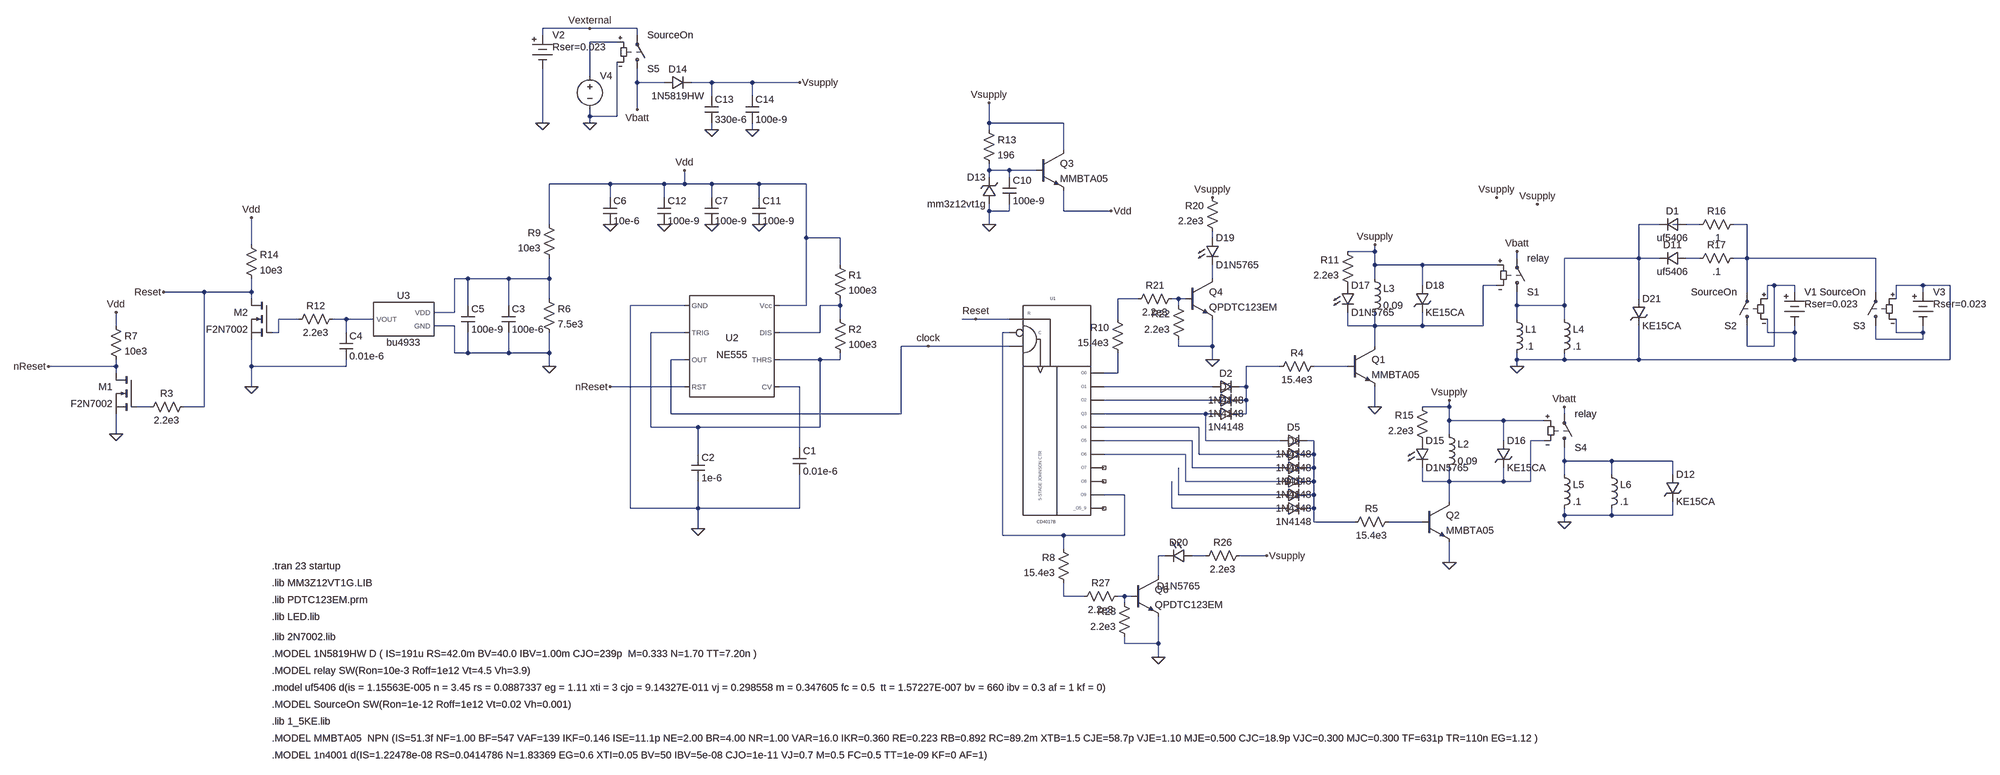
[diagram p0: schematic LockSequencer-7.asc]
LockSequencer-7.asc, the LTspice schematic file:
Version 4
SHEET 1 3068 1176
WIRE -880 -704 -992 -704
WIRE -768 -704 -880 -704
WIRE -992 -688 -992 -704
WIRE -768 -688 -768 -704
WIRE -816 -672 -880 -672
WIRE -880 -592 -880 -672
WIRE -768 -576 -768 -608
WIRE -704 -576 -768 -576
WIRE -592 -576 -640 -576
WIRE -496 -576 -592 -576
WIRE -384 -576 -496 -576
WIRE -592 -544 -592 -576
WIRE -496 -544 -496 -576
WIRE -768 -512 -768 -576
WIRE -880 -496 -880 -512
WIRE -816 -496 -816 -624
WIRE -816 -496 -880 -496
WIRE -992 -480 -992 -608
WIRE -880 -480 -880 -496
WIRE 64 -480 64 -528
WIRE 240 -480 64 -480
WIRE -592 -464 -592 -480
WIRE -496 -464 -496 -480
WIRE 64 -464 64 -480
WIRE 240 -416 240 -480
WIRE 64 -368 64 -384
WIRE 112 -368 64 -368
WIRE 176 -368 112 -368
WIRE 64 -352 64 -368
WIRE 112 -352 112 -368
WIRE -832 -336 -976 -336
WIRE -704 -336 -832 -336
WIRE -656 -336 -656 -368
WIRE -656 -336 -704 -336
WIRE -592 -336 -656 -336
WIRE -480 -336 -592 -336
WIRE -368 -336 -480 -336
WIRE -832 -304 -832 -336
WIRE -704 -304 -704 -336
WIRE -592 -304 -592 -336
WIRE -480 -304 -480 -336
WIRE 64 -272 64 -288
WIRE 112 -272 112 -288
WIRE 112 -272 64 -272
WIRE 240 -272 240 -320
WIRE 352 -272 240 -272
WIRE -976 -240 -976 -336
WIRE 64 -240 64 -272
WIRE 1648 -240 1600 -240
WIRE 1696 -240 1680 -240
WIRE 1744 -240 1712 -240
WIRE 1856 -240 1824 -240
WIRE -368 -208 -368 -336
WIRE -288 -208 -368 -208
WIRE 592 -208 592 -224
WIRE -1680 -192 -1680 -256
WIRE 976 -176 976 -192
WIRE 976 -176 912 -176
WIRE 1312 -160 1312 -176
WIRE 1600 -160 1600 -240
WIRE 1600 -160 1424 -160
WIRE 1648 -160 1600 -160
WIRE 1744 -160 1712 -160
WIRE 1856 -160 1856 -240
WIRE 1856 -160 1824 -160
WIRE 2160 -160 1856 -160
WIRE -288 -144 -288 -208
WIRE 976 -144 976 -176
WIRE 1088 -144 976 -144
WIRE 1264 -144 1088 -144
WIRE -1168 -112 -1200 -112
WIRE -1072 -112 -1168 -112
WIRE -976 -112 -976 -160
WIRE -976 -112 -1072 -112
WIRE 592 -112 592 -144
WIRE 976 -112 976 -144
WIRE 1088 -96 1088 -144
WIRE 1264 -96 1232 -96
WIRE 1920 -96 1904 -96
WIRE 1968 -96 1920 -96
WIRE 2272 -96 2208 -96
WIRE 2336 -96 2272 -96
WIRE -1792 -80 -1888 -80
WIRE -1680 -80 -1680 -112
WIRE -1680 -80 -1792 -80
WIRE 1856 -80 1856 -160
WIRE 1968 -80 1968 -96
WIRE 2160 -80 2160 -160
WIRE 2272 -80 2272 -96
WIRE -1680 -64 -1680 -80
WIRE -976 -64 -976 -112
WIRE 416 -64 368 -64
WIRE 512 -64 496 -64
WIRE 528 -64 512 -64
WIRE 1600 -64 1600 -160
WIRE 1904 -64 1904 -96
WIRE 2208 -64 2208 -96
WIRE -1168 -48 -1168 -112
WIRE -1072 -48 -1072 -112
WIRE -656 -48 -784 -48
WIRE -368 -48 -368 -208
WIRE -368 -48 -432 -48
WIRE -288 -48 -288 -64
WIRE -288 -48 -336 -48
WIRE 512 -48 512 -64
WIRE 1312 -48 1312 -80
WIRE 1424 -48 1424 -160
WIRE 1424 -48 1312 -48
WIRE -1200 -32 -1200 -112
WIRE -1200 -32 -1248 -32
WIRE -1568 -16 -1616 -16
WIRE -1456 -16 -1488 -16
WIRE -1392 -16 -1456 -16
WIRE -288 -16 -288 -48
WIRE 32 -16 0 -16
WIRE 112 -16 32 -16
WIRE 368 -16 368 -64
WIRE 1312 -16 1312 -48
WIRE 1424 -16 1424 -48
WIRE -2000 0 -2000 -32
WIRE -1200 0 -1248 0
WIRE 912 0 912 -32
WIRE 976 0 976 -32
WIRE 976 0 912 0
WIRE 1088 0 1088 -32
WIRE 1088 0 976 0
WIRE 1232 0 1232 -96
WIRE 1232 0 1088 0
WIRE -1616 16 -1616 -16
WIRE -1616 16 -1632 16
WIRE -1456 16 -1456 -16
WIRE -656 16 -736 16
WIRE -336 16 -336 -48
WIRE -336 16 -432 16
WIRE 112 16 96 16
WIRE 1904 16 1904 -16
WIRE 1968 16 1968 0
WIRE 1968 16 1904 16
WIRE 2208 16 2208 -16
WIRE 2272 16 2272 0
WIRE 2272 16 2208 16
WIRE 2160 32 2160 0
WIRE 2272 32 2272 16
WIRE 2272 32 2160 32
WIRE -80 48 -144 48
WIRE 112 48 -80 48
WIRE 512 48 512 32
WIRE 592 48 592 -16
WIRE 592 48 512 48
WIRE 976 48 976 0
WIRE 1856 48 1856 0
WIRE 1920 48 1920 -96
WIRE 1920 48 1856 48
WIRE -1200 64 -1200 0
WIRE -1168 64 -1168 16
WIRE -1168 64 -1200 64
WIRE -1072 64 -1072 16
WIRE -1072 64 -1168 64
WIRE -976 64 -976 16
WIRE -976 64 -1072 64
WIRE -656 80 -688 80
WIRE -336 80 -432 80
WIRE -288 80 -288 64
WIRE -288 80 -336 80
WIRE 592 80 592 48
WIRE 1312 80 1312 64
WIRE 1424 80 1424 64
WIRE 1424 80 1312 80
WIRE 1600 80 1600 0
WIRE 1600 80 1424 80
WIRE 1968 80 1968 16
WIRE 1968 80 1600 80
WIRE 2336 80 2336 -96
WIRE 2336 80 1968 80
WIRE -2000 96 -2000 80
WIRE -2000 96 -2160 96
WIRE -1680 96 -1680 32
WIRE -1456 96 -1456 80
WIRE -1456 96 -1680 96
WIRE -976 96 -976 64
WIRE 752 96 672 96
WIRE 912 96 832 96
WIRE 1312 96 1312 80
WIRE -2000 112 -2000 96
WIRE 368 112 368 64
WIRE 368 112 336 112
WIRE -1680 144 -1680 96
WIRE -656 144 -832 144
WIRE -384 144 -432 144
WIRE 592 144 336 144
WIRE 672 144 672 96
WIRE 672 144 656 144
WIRE 592 176 336 176
WIRE 672 176 672 144
WIRE 672 176 656 176
WIRE -1920 192 -1952 192
WIRE -1792 192 -1792 -80
WIRE -1792 192 -1840 192
WIRE 976 192 976 144
WIRE 1152 192 1152 176
WIRE 1152 192 1088 192
WIRE -688 208 -688 80
WIRE -144 208 -144 48
WIRE -144 208 -688 208
WIRE 576 208 336 208
WIRE 592 208 576 208
WIRE 672 208 672 176
WIRE 672 208 656 208
WIRE 1424 208 1424 192
WIRE 1152 224 1152 192
WIRE 1280 224 1152 224
WIRE 1376 224 1280 224
WIRE -736 240 -736 16
WIRE -624 240 -736 240
WIRE -336 240 -336 80
WIRE -336 240 -624 240
WIRE 560 240 336 240
WIRE -2000 256 -2000 208
WIRE 1152 256 1152 224
WIRE 544 272 336 272
WIRE 576 272 576 208
WIRE 752 272 576 272
WIRE 832 272 816 272
WIRE 1280 272 1280 224
WIRE 1376 272 1344 272
WIRE -384 288 -384 144
WIRE -624 304 -624 240
WIRE 528 304 336 304
WIRE 560 304 560 240
WIRE 752 304 560 304
WIRE 832 304 832 272
WIRE 832 304 816 304
WIRE 1424 320 1424 288
WIRE 1536 320 1424 320
WIRE 1680 320 1536 320
WIRE 544 336 544 272
WIRE 752 336 544 336
WIRE 832 336 832 304
WIRE 832 336 816 336
WIRE 1424 352 1424 320
WIRE 1536 352 1536 320
WIRE 1680 352 1680 320
WIRE 528 368 528 304
WIRE 752 368 528 368
WIRE 832 368 832 336
WIRE 832 368 816 368
WIRE 1088 368 1088 336
WIRE 1152 368 1152 336
WIRE 1152 368 1088 368
WIRE 1280 368 1280 336
WIRE 1280 368 1152 368
WIRE 1344 368 1344 272
WIRE 1344 368 1280 368
WIRE 384 400 336 400
WIRE 512 400 512 336
WIRE 752 400 512 400
WIRE 832 400 832 368
WIRE 832 400 816 400
WIRE 1152 416 1152 368
WIRE -784 432 -784 -48
WIRE -624 432 -624 368
WIRE -624 432 -784 432
WIRE -384 432 -384 352
WIRE -384 432 -624 432
WIRE 496 432 496 368
WIRE 752 432 496 432
WIRE 832 432 832 400
WIRE 832 432 816 432
WIRE 1424 448 1424 432
WIRE 1536 448 1536 432
WIRE 1536 448 1424 448
WIRE 1680 448 1680 416
WIRE 1680 448 1536 448
WIRE 832 464 832 432
WIRE 928 464 832 464
WIRE 1088 464 1008 464
WIRE 1424 464 1424 448
WIRE -624 480 -624 432
WIRE 96 496 96 16
WIRE 240 496 96 496
WIRE 384 496 384 400
WIRE 384 496 240 496
WIRE 240 528 240 496
WIRE 480 544 464 544
WIRE 576 544 544 544
WIRE 720 544 656 544
WIRE 1152 560 1152 512
WIRE 464 592 464 544
WIRE 240 640 240 608
WIRE 288 640 240 640
WIRE 384 640 368 640
WIRE 400 640 384 640
WIRE 384 656 384 640
WIRE 384 752 384 736
WIRE 464 752 464 688
WIRE 464 752 384 752
WIRE 464 784 464 752
FLAG -624 480 0
FLAG -656 -368 Vdd
FLAG -976 96 0
FLAG -1680 144 0
FLAG -1888 -80 Reset
FLAG 32 -16 Reset
FLAG -2000 -32 Vdd
FLAG -1680 -256 Vdd
FLAG -2160 96 nReset
FLAG -832 144 nReset
FLAG -2000 256 0
FLAG 976 192 0
FLAG -832 -240 0
FLAG -592 -240 0
FLAG -768 -512 Vbatt
FLAG 64 -240 0
FLAG 64 -528 Vsupply
FLAG 352 -272 Vdd
FLAG -384 -576 Vsupply
FLAG 1152 176 Vsupply
FLAG -80 48 clock
FLAG 976 -192 Vsupply
FLAG 1424 192 Vbatt
FLAG 1312 96 0
FLAG 1312 -176 Vbatt
FLAG 1424 464 0
FLAG 1264 -304 Vsupply
FLAG 1360 -288 Vsupply
FLAG -496 -464 0
FLAG -592 -464 0
FLAG -480 -240 0
FLAG -704 -240 0
FLAG -992 -480 0
FLAG -880 -480 0
FLAG 592 80 0
FLAG 592 -304 Vsupply
FLAG -880 -704 Vexternal
FLAG 464 784 0
FLAG 720 544 Vsupply
FLAG 1152 560 0
SYMBOL Misc\\NE555 -544 48 R0
SYMATTR InstName U2
SYMBOL cap -400 288 R0
SYMATTR InstName C1
SYMATTR Value 0.01e-6
SYMATTR SpiceLine V=16
SYMBOL cap -640 304 R0
SYMATTR InstName C2
SYMATTR Value 1e-6
SYMATTR SpiceLine V=16
SYMBOL res -304 -160 R0
SYMATTR InstName R1
SYMATTR Value 100e3
SYMBOL res -304 -32 R0
SYMATTR InstName R2
SYMATTR Value 100e3
SYMBOL cap -1088 -48 R0
SYMATTR InstName C3
SYMATTR Value 100e-6
SYMATTR SpiceLine V=16
SYMBOL res -992 -80 R0
SYMATTR InstName R6
SYMATTR Value 7.5e3
SYMBOL res -960 -144 R180
WINDOW 0 36 76 Left 2
WINDOW 3 36 40 Left 2
SYMATTR InstName R9
SYMATTR Value 10e3
SYMBOL bu4933 -1328 -16 R0
SYMATTR InstName U3
SYMBOL res -1472 -32 R90
WINDOW 0 0 56 VBottom 2
WINDOW 3 32 56 VTop 2
SYMATTR InstName R12
SYMATTR Value 2.2e3
SYMBOL res -1696 -208 R0
SYMATTR InstName R14
SYMATTR Value 10e3
SYMBOL nmos -1632 -64 M0
SYMATTR InstName M2
SYMATTR Value F2N7002
SYMATTR Prefix X
SYMBOL nmos -1952 112 M0
SYMATTR InstName M1
SYMATTR Value F2N7002
SYMATTR Prefix X
SYMBOL res -2016 -16 R0
SYMATTR InstName R7
SYMATTR Value 10e3
SYMBOL cap -1184 -48 R0
SYMATTR InstName C5
SYMATTR Value 100e-9
SYMATTR SpiceLine V=16
SYMBOL diode 592 160 R270
WINDOW 0 32 32 VTop 2
WINDOW 3 0 32 VBottom 2
SYMATTR InstName D2
SYMATTR Value 1N4148
SYMBOL diode 592 192 R270
WINDOW 0 32 32 VTop 2
WINDOW 3 0 32 VBottom 2
SYMATTR InstName D3
SYMATTR Value 1N4148
SYMBOL diode 592 224 R270
WINDOW 0 32 32 VTop 2
WINDOW 3 0 32 VBottom 2
SYMATTR InstName D4
SYMATTR Value 1N4148
SYMBOL diode 752 288 R270
WINDOW 0 32 32 VTop 2
WINDOW 3 0 32 VBottom 2
SYMATTR InstName D5
SYMATTR Value 1N4148
SYMBOL diode 752 320 R270
WINDOW 0 32 32 VTop 2
WINDOW 3 0 32 VBottom 2
SYMATTR InstName D6
SYMATTR Value 1N4148
SYMBOL diode 752 352 R270
WINDOW 0 32 32 VTop 2
WINDOW 3 0 32 VBottom 2
SYMATTR InstName D7
SYMATTR Value 1N4148
SYMBOL diode 752 448 R270
WINDOW 0 32 32 VTop 2
WINDOW 3 0 32 VBottom 2
SYMATTR InstName D8
SYMATTR Value 1N4148
SYMBOL diode 752 384 R270
WINDOW 0 32 32 VTop 2
WINDOW 3 0 32 VBottom 2
SYMATTR InstName D9
SYMATTR Value 1N4148
SYMBOL diode 752 416 R270
WINDOW 0 32 32 VTop 2
WINDOW 3 0 32 VBottom 2
SYMATTR InstName D10
SYMATTR Value 1N4148
SYMBOL cap -848 -304 R0
SYMATTR InstName C6
SYMATTR Value 10e-6
SYMATTR SpiceLine V=16
SYMBOL cap -608 -304 R0
SYMATTR InstName C7
SYMATTR Value 100e-9
SYMATTR SpiceLine V=16
SYMBOL ind 1136 240 R0
SYMATTR InstName L2
SYMATTR Value 0.09
SYMATTR SpiceLine Rser=320
SYMBOL Misc\\battery -992 -704 R0
WINDOW 123 0 0 Left 2
WINDOW 39 24 44 Left 2
WINDOW 3 24 104 Invisible 2
SYMATTR SpiceLine Rser=0.023
SYMATTR Value PWL(0 0 .25 5 0.5 5 0.55 12.75 2 12.75 3 13.8 3.1 0)
SYMATTR InstName V2
SYMBOL diode -704 -560 R270
WINDOW 0 32 32 VTop 2
WINDOW 3 0 32 VBottom 2
SYMATTR InstName D14
SYMATTR Value 1N5819HW
SYMBOL res 48 -480 R0
SYMATTR InstName R13
SYMATTR Value 196
SYMBOL zener 80 -288 R180
WINDOW 0 24 64 Left 2
WINDOW 3 24 0 Left 2
SYMATTR InstName D13
SYMATTR Value mm3z12vt1g
SYMATTR Prefix X
SYMBOL cap 96 -352 R0
SYMATTR InstName C10
SYMATTR Value 100e-9
SYMATTR SpiceLine V=16
SYMBOL LED 1072 272 R0
SYMATTR InstName D15
SYMATTR Value D1N5765
SYMATTR Prefix X
SYMBOL ind 960 -128 R0
SYMATTR InstName L3
SYMATTR Value 0.09
SYMATTR SpiceLine Rser=320
SYMBOL LED 896 -96 R0
SYMATTR InstName D17
SYMATTR Value D1N5765
SYMATTR Prefix X
SYMBOL sw 1312 -64 M180
SYMATTR InstName S1
SYMATTR Value relay
SYMBOL ind 1296 -32 R0
SYMATTR InstName L1
SYMATTR Value .1
SYMATTR SpiceLine Rser=12
SYMBOL ind 1408 -32 R0
SYMATTR InstName L4
SYMATTR Value .1
SYMATTR SpiceLine Rser=12
SYMBOL Misc\\battery 1968 -96 R0
WINDOW 123 0 0 Left 2
WINDOW 39 24 44 Left 2
WINDOW 3 24 104 Invisible 2
SYMATTR SpiceLine Rser=0.023
SYMATTR Value PWL(0 0 13.19 0 13.2 12.6 16 12.6 16.01 0)
SYMATTR InstName V1
SYMBOL sw 1856 16 R180
SYMATTR InstName S2
SYMATTR Value SourceOn
SYMBOL Misc\\battery 2272 -96 R0
WINDOW 123 0 0 Left 2
WINDOW 39 24 44 Left 2
WINDOW 3 24 104 Invisible 2
SYMATTR SpiceLine Rser=0.023
SYMATTR Value PWL(0 0 20 0 20.01 12.6 22.00 12.6 22.01 0)
SYMATTR InstName V3
SYMBOL sw 2160 16 R180
SYMATTR InstName S3
SYMATTR Value SourceOn
SYMBOL diode 1712 -176 R90
WINDOW 0 0 32 VBottom 2
WINDOW 3 32 32 VTop 2
SYMATTR InstName D11
SYMATTR Value uf5406
SYMBOL sw 1424 304 M180
SYMATTR InstName S4
SYMATTR Value relay
SYMBOL ind 1408 336 R0
SYMATTR InstName L5
SYMATTR Value .1
SYMATTR SpiceLine Rser=12
SYMBOL ind 1520 336 R0
SYMATTR InstName L6
SYMATTR Value .1
SYMATTR SpiceLine Rser=12
SYMBOL cap -496 -304 R0
SYMATTR InstName C11
SYMATTR Value 100e-9
SYMATTR SpiceLine V=16
SYMBOL cap -720 -304 R0
SYMATTR InstName C12
SYMATTR Value 100e-9
SYMATTR SpiceLine V=16
SYMBOL cap -608 -544 R0
SYMATTR InstName C13
SYMATTR Value 330e-6
SYMATTR SpiceLine V=16
SYMBOL cap -512 -544 R0
SYMATTR InstName C14
SYMATTR Value 100e-9
SYMATTR SpiceLine V=16
SYMBOL LED 576 -208 R0
SYMATTR InstName D19
SYMATTR Value D1N5765
SYMATTR Prefix X
SYMBOL res 608 -208 R180
WINDOW 0 36 76 Left 2
WINDOW 3 36 40 Left 2
SYMATTR InstName R20
SYMATTR Value 2.2e3
SYMBOL sw -768 -592 M180
SYMATTR InstName S5
SYMATTR Value SourceOn
SYMBOL voltage -880 -608 R0
WINDOW 3 24 96 Invisible 2
WINDOW 123 0 0 Left 2
WINDOW 39 0 0 Left 2
SYMATTR Value PWL(0 1 3.1 1 3.11 0)
SYMATTR InstName V4
SYMBOL npn 528 -112 R0
SYMATTR InstName Q4
SYMATTR Value QPDTC123EM
SYMBOL res 512 -80 R90
WINDOW 0 0 56 VBottom 2
WINDOW 3 32 56 VTop 2
SYMATTR InstName R21
SYMATTR Value 2.2e3
SYMBOL res 528 48 R180
WINDOW 0 36 76 Left 2
WINDOW 3 36 40 Left 2
SYMATTR InstName R22
SYMATTR Value 2.2e3
SYMBOL res 560 560 R270
WINDOW 0 32 56 VTop 2
WINDOW 3 0 56 VBottom 2
SYMATTR InstName R26
SYMATTR Value 2.2e3
SYMBOL npn 400 592 R0
SYMATTR InstName Q6
SYMATTR Value QPDTC123EM
SYMBOL res 384 624 R90
WINDOW 0 0 56 VBottom 2
WINDOW 3 32 56 VTop 2
SYMATTR InstName R27
SYMATTR Value 2.2e3
SYMBOL res 400 752 R180
WINDOW 0 36 76 Left 2
WINDOW 3 36 40 Left 2
SYMATTR InstName R28
SYMATTR Value 2.2e3
SYMBOL LED 544 528 R90
WINDOW 0 0 32 VBottom 2
WINDOW 3 72 32 VTop 2
SYMATTR InstName D20
SYMATTR Value D1N5765
SYMATTR Prefix X
SYMBOL cap -1472 16 R0
SYMATTR InstName C4
SYMATTR Value 0.01e-6
SYMATTR SpiceLine V=16
SYMBOL res -1824 176 R90
WINDOW 0 0 56 VBottom 2
WINDOW 3 32 56 VTop 2
SYMATTR InstName R3
SYMATTR Value 2.2e3
SYMBOL npn 912 48 R0
SYMATTR InstName Q1
SYMATTR Value MMBTA05
SYMBOL res 848 80 R90
WINDOW 0 0 56 VBottom 2
WINDOW 3 32 56 VTop 2
SYMATTR InstName R4
SYMATTR Value 15.4e3
SYMBOL npn 1088 416 R0
SYMATTR InstName Q2
SYMATTR Value MMBTA05
SYMBOL res 1024 448 R90
WINDOW 0 0 56 VBottom 2
WINDOW 3 32 56 VTop 2
SYMATTR InstName R5
SYMATTR Value 15.4e3
SYMBOL res 384 80 R180
WINDOW 0 36 76 Left 2
WINDOW 3 36 40 Left 2
SYMATTR InstName R10
SYMATTR Value 15.4e3
SYMBOL res 256 624 R180
WINDOW 0 36 76 Left 2
WINDOW 3 36 40 Left 2
SYMATTR InstName R8
SYMATTR Value 15.4e3
SYMBOL npn 176 -416 R0
SYMATTR InstName Q3
SYMATTR Value MMBTA05
SYMBOL res 928 -80 R180
WINDOW 0 36 76 Left 2
WINDOW 3 36 40 Left 2
SYMATTR InstName R11
SYMATTR Value 2.2e3
SYMBOL res 1104 288 R180
WINDOW 0 36 76 Left 2
WINDOW 3 36 40 Left 2
SYMATTR InstName R15
SYMATTR Value 2.2e3
SYMBOL diode 1712 -256 R90
WINDOW 0 0 32 VBottom 2
WINDOW 3 32 32 VTop 2
SYMATTR InstName D1
SYMATTR Value uf5406
SYMBOL TVSdiode 1072 -96 R0
SYMATTR InstName D18
SYMATTR Value KE15CA
SYMATTR Prefix X
SYMBOL TVSdiode 1584 -64 R0
SYMATTR InstName D21
SYMATTR Value KE15CA
SYMATTR Prefix X
SYMBOL res 1840 -256 R90
WINDOW 0 0 56 VBottom 2
WINDOW 3 32 56 VTop 2
SYMATTR InstName R16
SYMATTR Value .1
SYMBOL res 1840 -176 R90
WINDOW 0 0 56 VBottom 2
WINDOW 3 32 56 VTop 2
SYMATTR InstName R17
SYMATTR Value .1
SYMBOL TVSdiode 1664 352 R0
SYMATTR InstName D12
SYMATTR Value KE15CA
SYMATTR Prefix X
SYMBOL TVSdiode 1264 272 R0
SYMATTR InstName D16
SYMATTR Value KE15CA
SYMATTR Prefix X
SYMBOL cd4017b 224 -80 R0
SYMATTR InstName U1
SYMATTR SpiceLine VDD=11.298  SPEED=1.0  TRIPDT=5e-9
TEXT -1632 568 Left 2 !.tran 23 startup
TEXT -1632 608 Left 2 !.lib MM3Z12VT1G.LIB
TEXT -1632 648 Left 2 !.lib PDTC123EM.prm
TEXT -1632 736 Left 2 !.lib 2N7002.lib
TEXT -1632 776 Left 2 !.MODEL 1N5819HW D ( IS=191u RS=42.0m BV=40.0 IBV=1.00m CJO=239p  M=0.333 N=1.70 TT=7.20n )
TEXT -1632 688 Left 2 !.lib LED.lib
TEXT -1632 816 Left 2 !.MODEL relay SW(Ron=10e-3 Roff=1e12 Vt=4.5 Vh=3.9)
TEXT -1632 856 Left 2 !.model uf5406 d(is = 1.15563E-005 n = 3.45 rs = 0.0887337 eg = 1.11 xti = 3 cjo = 9.14327E-011 vj = 0.298558 m = 0.347605 fc = 0.5  tt = 1.57227E-007 bv = 660 ibv = 0.3 af = 1 kf = 0)
TEXT -1632 896 Left 2 !.MODEL SourceOn SW(Ron=1e-12 Roff=1e12 Vt=0.02 Vh=0.001)
TEXT -1632 936 Left 2 !.lib 1_5KE.lib
TEXT -1632 976 Left 2 !.MODEL MMBTA05  NPN (IS=51.3f NF=1.00 BF=547 VAF=139 IKF=0.146 ISE=11.1p NE=2.00 BR=4.00 NR=1.00 VAR=16.0 IKR=0.360 RE=0.223 RB=0.892 RC=89.2m XTB=1.5 CJE=58.7p VJE=1.10 MJE=0.500 CJC=18.9p VJC=0.300 MJC=0.300 TF=631p TR=110n EG=1.12 )
TEXT -1632 1016 Left 2 !.MODEL 1n4001 d(IS=1.22478e-08 RS=0.0414786 N=1.83369 EG=0.6 XTI=0.05 BV=50 IBV=5e-08 CJO=1e-11 VJ=0.7 M=0.5 FC=0.5 TT=1e-09 KF=0 AF=1)

The netlist it stands for:
* LockSequencer-7.asc
XU2 0 N018 clock nReset N024 N018 N015 Vdd NE555  ; pins GND TRIG OUT RST CV THRS DIS Vcc
C1 N024 0 0.01e-6 V=16
C2 N018 0 1e-6 V=16
R1 Vdd N015 100e3
R2 N015 N018 100e3
C3 N009 0 100e-6 V=16
R6 N009 0 7.5e3
R9 N009 Vdd 10e3
XU3 N017 N009 0 bu4933  ; pins VOUT VDD GND
R12 N017 N016 2.2e3
R14 Vdd Reset 10e3
XM2 Reset N016 0 F2N7002  ; pins D G S
XM1 nReset N027 0 F2N7002  ; pins D G S
R7 Vdd nReset 10e3
C5 N009 0 100e-9 V=16
D2 N025 N021 1N4148
D3 N026 N021 1N4148
D4 N028 N021 1N4148
D5 N028 N031 1N4148
D6 N029 N031 1N4148
D7 N030 N031 1N4148
D8 N036 N031 1N4148
D9 N033 N031 1N4148
D10 N035 N031 1N4148
C6 Vdd 0 10e-6 V=16
C7 Vdd 0 100e-9 V=16
L2 Vsupply N032 0.09 Rser=320
V2 Vexternal 0 PWL(0 0 .25 5 0.5 5 0.55 12.75 2 12.75 3 13.8 3.1 0) Rser=0.023
D14 Vbatt Vsupply 1N5819HW
R13 Vsupply N002 196
XD13 0 N002 mm3z12vt1g  ; pins + -
C10 N002 0 100e-9 V=16
XD15 P001 N032 D1N5765  ; pins + -
L3 Vsupply N011 0.09 Rser=320
XD17 P002 N011 D1N5765  ; pins + -
S1 N003 Vbatt Vsupply N011 relay
L1 N003 0 .1 Rser=12
L4 N003 0 .1 Rser=12
V1 N012 0 PWL(0 0 13.19 0 13.2 12.6 16 12.6 16.01 0) Rser=0.023
S2 N012 N006 N012 0 SourceOn
V3 0 N020 PWL(0 0 20 0 20.01 12.6 22.00 12.6 22.01 0) Rser=0.023
S3 N020 N006 0 N020 SourceOn
D11 N008 N003 uf5406
S4 N034 Vbatt Vsupply N032 relay
L5 N034 0 .1 Rser=12
L6 N034 0 .1 Rser=12
C11 Vdd 0 100e-9 V=16
C12 Vdd 0 100e-9 V=16
C13 Vsupply 0 330e-6 V=16
C14 Vsupply 0 100e-9 V=16
XD19 N007 N010 D1N5765  ; pins + -
R20 N007 Vsupply 2.2e3
S5 Vbatt Vexternal N001 0 SourceOn
V4 N001 0 PWL(0 1 3.1 1 3.11 0)
Q4 N010 N014 0 0 QPDTC123EM
R21 N014 N013 2.2e3
R22 0 N014 2.2e3
R26 N039 Vsupply 2.2e3
Q6 N038 N041 0 0 QPDTC123EM
R27 N041 N040 2.2e3
R28 0 N041 2.2e3
XD20 N039 N038 D1N5765  ; pins + -
C4 N017 0 0.01e-6 V=16
R3 Reset N027 2.2e3
Q1 N011 N022 0 0 MMBTA05
R4 N022 N021 15.4e3
Q2 N032 N037 0 0 MMBTA05
R5 N037 N031 15.4e3
R10 N023 N013 15.4e3
R8 N040 N019 15.4e3
Q3 Vsupply N002 Vdd 0 MMBTA05
R11 P002 Vsupply 2.2e3
R15 P001 Vsupply 2.2e3
D1 N005 N003 uf5406
XD18 Vsupply N011 KE15CA  ; pins + -
XD21 N003 0 KE15CA  ; pins + -
R16 N006 N005 .1
R17 N006 N008 .1
XD12 N034 0 KE15CA  ; pins + -
XD16 Vsupply N032 KE15CA  ; pins + -
XU1 Reset N019 clock N023 N025 N026 N028 N029 N030 N033 NC_01 NC_02 N019 NC_03 VDD 0 CD4017B VDD=11.298  SPEED=1.0  TRIPDT=5e-9  ; pins MR CPN CP Q0 Q1 Q2 Q3 Q4 Q5 Q6 Q7 Q8 Q9 Q59
.model D D
.lib standard.dio
.model NPN NPN
.model PNP PNP
.lib standard.bjt
.tran 23 startup
.lib MM3Z12VT1G.LIB
.lib PDTC123EM.prm
.lib 2N7002.lib
.MODEL 1N5819HW D ( IS=191u RS=42.0m BV=40.0 IBV=1.00m CJO=239p  M=0.333 N=1.70 TT=7.20n )
.lib LED.lib
.MODEL relay SW(Ron=10e-3 Roff=1e12 Vt=4.5 Vh=3.9)
.model uf5406 d(is = 1.15563E-005 n = 3.45 rs = 0.0887337 eg = 1.11 xti = 3 cjo = 9.14327E-011 vj = 0.298558 m = 0.347605 fc = 0.5  tt = 1.57227E-007 bv = 660 ibv = 0.3 af = 1 kf = 0)
.MODEL SourceOn SW(Ron=1e-12 Roff=1e12 Vt=0.02 Vh=0.001)
.lib 1_5KE.lib
.MODEL MMBTA05  NPN (IS=51.3f NF=1.00 BF=547 VAF=139 IKF=0.146 ISE=11.1p NE=2.00 BR=4.00 NR=1.00 VAR=16.0 IKR=0.360 RE=0.223 RB=0.892 RC=89.2m XTB=1.5 CJE=58.7p VJE=1.10 MJE=0.500 CJC=18.9p VJC=0.300 MJC=0.300 TF=631p TR=110n EG=1.12 )
.MODEL 1n4001 d(IS=1.22478e-08 RS=0.0414786 N=1.83369 EG=0.6 XTI=0.05 BV=50 IBV=5e-08 CJO=1e-11 VJ=0.7 M=0.5 FC=0.5 TT=1e-09 KF=0 AF=1)
.lib NE555.sub
.lib BU4933.LIB
.lib cd4000.lib
.backanno
.end